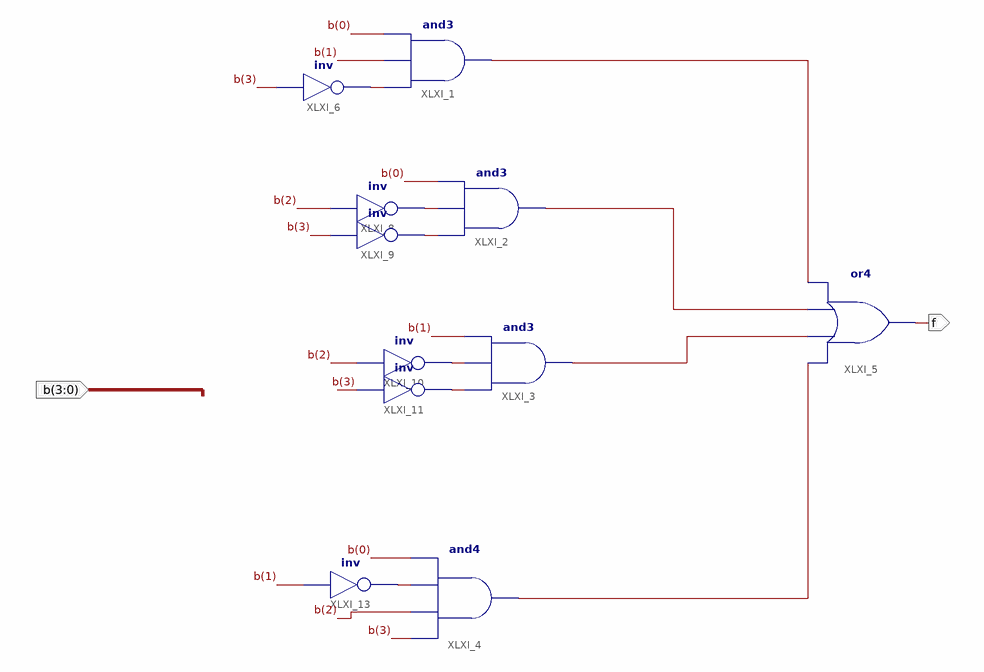
[diagram p0: schematic sheet 1]
// Xilinx ISE schematic f.sch (artix7) as structural Verilog: 11 symbols, 2 ports
module f (
  input  [3:0] b,
  output f
);

  wire XLXN_2, XLXN_3, XLXN_4, XLXN_5, XLXN_6, XLXN_7, XLXN_8, XLXN_9, XLXN_10, XLXN_11;

  and XLXI_1 (XLXN_8, XLXN_2, b[1], b[0]);
  and XLXI_2 (XLXN_9, XLXN_4, XLXN_3, b[0]);
  and XLXI_3 (XLXN_10, XLXN_6, XLXN_5, b[1]);
  and XLXI_4 (XLXN_11, b[3], b[2], XLXN_7, b[0]);
  or XLXI_5 (f, XLXN_11, XLXN_10, XLXN_9, XLXN_8);
  not XLXI_6 (XLXN_2, b[3]);
  not XLXI_8 (XLXN_3, b[2]);
  not XLXI_9 (XLXN_4, b[3]);
  not XLXI_10 (XLXN_5, b[2]);
  not XLXI_11 (XLXN_6, b[3]);
  not XLXI_13 (XLXN_7, b[1]);
endmodule
